# Altium schematic sheet MCU.SchDoc
size A; SheetNumber: 2; SheetTotal: 3
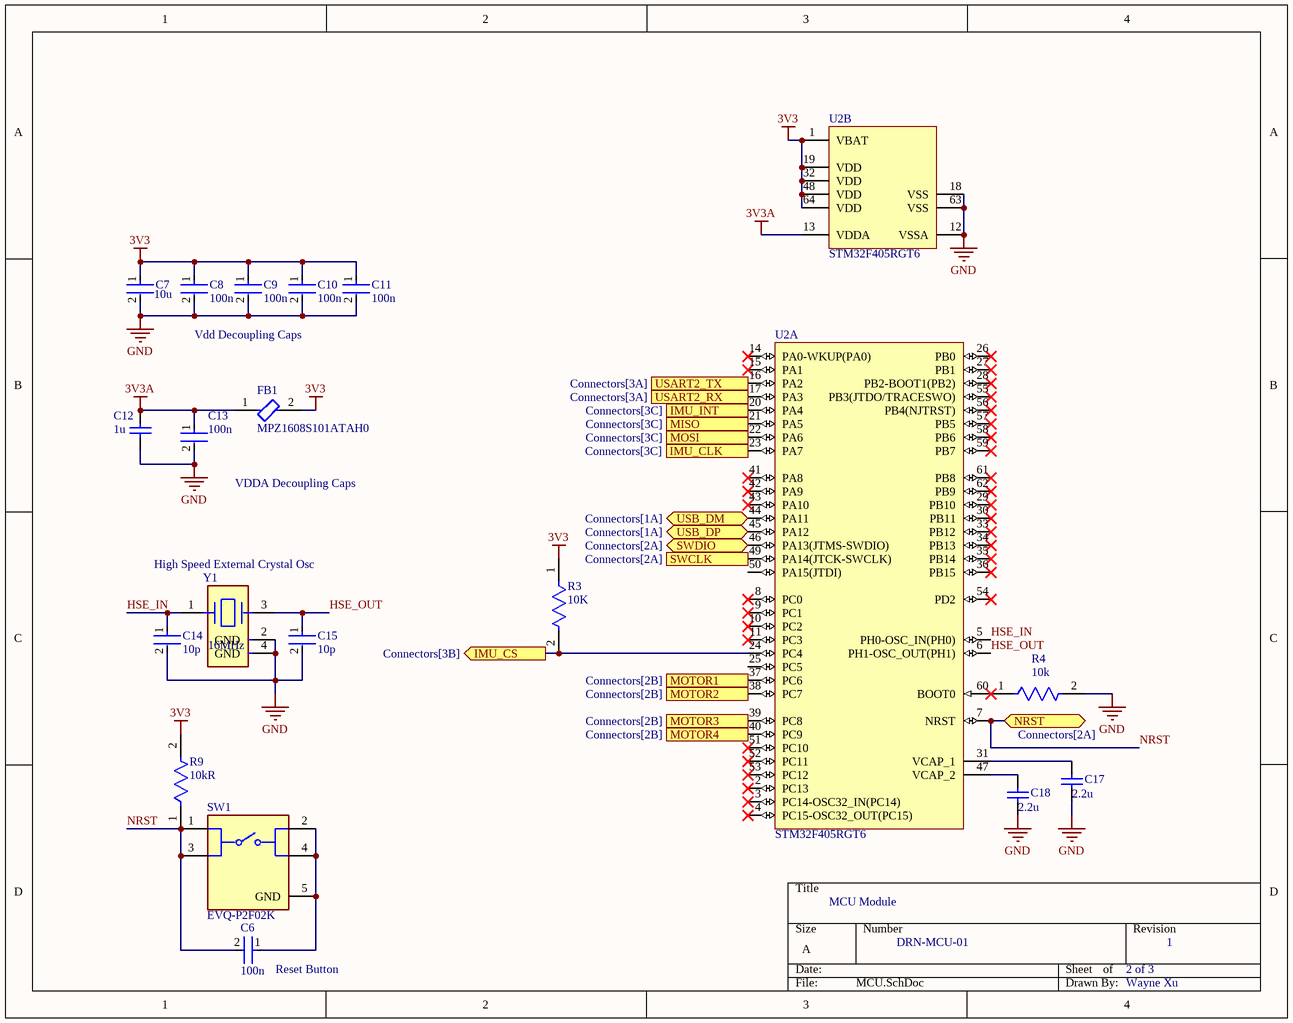
[diagram p0: MCU.SchDoc]

## Parts
C6  100n  [FP-C0603C-CF-MFG]
C7  10u  [FP-GRM155-0_2-MFG]
C8  100n  [FP-C0603C-CF-MFG]
C9  100n  [FP-C0603C-CF-MFG]
C10  100n  [FP-C0603C-CF-MFG]
C11  100n  [FP-C0603C-CF-MFG]
C12  1u  [CAPC2013X145X50LL20T25]
C13  100n  [FP-C0603C-CF-MFG]
C14  10p  [FP-C0603C-CF-MFG]
C15  10p  [FP-C0603C-CF-MFG]
C17  2.2u  [CAPC3216X180X50LL20T25]
C18  2.2u  [CAPC3216X180X50LL20T25]
FB1  MPZ1608S101ATAH0  [FP-MPZ1608-0_6-IPC_C]
R3  10K  [FP-AC0603-MFG]
R4  10k  [FP-AC0603-MFG]
R9  10kR  [FP-AC0603-MFG]
SW1  EVQ-P2F02K  [FP-EVQ-P2F02K-MFG]
U2  STM32F405RGT6  [STM-LQFP64_M]  (parts A,B of 2)
Y1  16MHz  [FP-ABM8W-MFG]

## Ports
IMU_CLK (out, see Connectors[3C]), IMU_CS (out, see Connectors[3B]), IMU_INT (in, see Connectors[3C]), MISO (in, see Connectors[3C]), MOSI (out, see Connectors[3C]), MOTOR1 (out, see Connectors[2B]), MOTOR2 (out, see Connectors[2B]), MOTOR3 (out, see Connectors[2B]), MOTOR4 (out, see Connectors[2B]), NRST (bidir, see Connectors[2A]), SWCLK (in, see Connectors[2A]), SWDIO (bidir, see Connectors[2A]), USART2_RX (in, see Connectors[3A]), USART2_TX (out, see Connectors[3A]), USB_DM (bidir, see Connectors[1A]), USB_DP (bidir, see Connectors[1A])

## Nets
3V3: C7.1 C8.1 C9.1 C10.1 C11.1 FB1.2 R3.1 R9.2 U2.1(VBAT) U2.19(VDD) U2.32(VDD) U2.48(VDD) U2.64(VDD)
3V3A: C12.1 C13.1 FB1.1 U2.13(VDDA)
GND: C7.2 C8.2 C9.2 C10.2 C11.2 C12.2 C13.2 C14.2 C15.2 C17.2 C18.2 R4.2 U2.12(VSSA) U2.18(VSS) U2.63(VSS) Y1.2(GND) Y1.4(GND)
HSE_IN: C14.1 U2.5(PH0-OSC_IN(PH0)) Y1.1
HSE_OUT: C15.1 U2.6(PH1-OSC_OUT(PH1)) Y1.3
IMU_CLK: U2.23(PA7) ; port IMU_CLK
IMU_CS: R3.2 U2.24(PC4) ; port IMU_CS
IMU_INT: U2.20(PA4) ; port IMU_INT
MISO: U2.21(PA5) ; port MISO
MOSI: U2.22(PA6) ; port MOSI
MOTOR1: U2.37(PC6) ; port MOTOR1
MOTOR2: U2.38(PC7) ; port MOTOR2
MOTOR3: U2.39(PC8) ; port MOTOR3
MOTOR4: U2.40(PC9) ; port MOTOR4
NRST: C6.2 R9.1 SW1.1 SW1.3 U2.7(NRST) ; port NRST
SWCLK: U2.49(PA14(JTCK-SWCLK)) ; port SWCLK
SWDIO: U2.46(PA13(JTMS-SWDIO)) ; port SWDIO
USART2_RX: U2.17(PA3) ; port USART2_RX
USART2_TX: U2.16(PA2) ; port USART2_TX
USB_DM: U2.44(PA11) ; port USB_DM
USB_DP: U2.45(PA12) ; port USB_DP
NetC6_1: C6.1 SW1.2 SW1.4 SW1.5(GND)
NetC17_1: C17.1 U2.31(VCAP_1)
NetC18_1: C18.1 U2.47(VCAP_2)
NetR4_1: R4.1 U2.60(BOOT0)

Not connected (* = marked no-connect by the designer): U2 2(PC13)* 3(PC14-OSC32_IN(PC14))* 4(PC15-OSC32_OUT(PC15))* 8(PC0)* 9(PC1)* 10(PC2)* 11(PC3)* 14(PA0-WKUP(PA0))* 15(PA1)* 25(PC5) 26(PB0)* 27(PB1)* 28(PB2-BOOT1(PB2))* 29(PB10)* 30(PB11)* 33(PB12)* 34(PB13)* 35(PB14)* 36(PB15)* 41(PA8)* 42(PA9)* 43(PA10)* 50(PA15(JTDI)) 51(PC10)* 52(PC11)* 53(PC12)* 54(PD2)* 55(PB3(JTDO/TRACESWO))* 56(PB4(NJTRST))* 57(PB5)* 58(PB6)* 59(PB7)* 61(PB8)* 62(PB9)*

## Notes on the sheet
- Vdd Decoupling Caps
- VDDA Decoupling Caps
- High Speed External Crystal Osc
- MCU Module
- (near C6) Reset Button
- DRN-MCU-01
- 2 of 3
- 1
- Wayne Xu

## Library data of the parts
C6 C8-C11 C13 = CMP-2006-03066-2: CAP CER 0.1UF 25V Y5V 0603; Manufacturer Part Number: C0603C104M3VACTU; Manufacturer: KEMET; Capacitance: 0.10 μF; Material: Ceramic; Temperature Coefficient: 30ppm/°C; Value: 0.10 μF; Automotive Grade: Grade 1; Tolerance: 0.2; Height: 0.87mm; Category: Cap; ComponentLink2Description: Datasheet; Temperature Range High: +125°C; Automotive: Yes; ComponentLink2URL: https://api.kemet.com/component-edge/download/datasheet/C0603C100J5GACAUTO.pdf; Mouser Description: Multilayer Ceramic Capacitors MLCC - SMD/SMT 25volts 0.1uF Y5V 20%; Device Class L2: Capacitors; Device Class L3: Ceramic Capacitors; Temperature: -55°C to +125°C; Lead Free: Yes; Temperature Range Low: -55°C; Package: C0603C-CF; RoHS: TRUE; Temperature Characteristic: Y5V; Octopart: https://octopart.com/c0603c104m3vactu-kemet-149363; Digikey Description: CAP CER 0.1UF 25V Y5V 0603; Voltage Rating: 25 V; Device Class L1: Passive Components
C7 = CMP-00260-135863761-1: GRM155D70G106ME18D SMD Chip Multilayer Ceramic Capacitor; Voltage Rating (DC): 4V; Dielectric: X7T; Capacitance: 10µF; Thickness: 500µm; Lifecycle Status: Production; Width: 500µm; Case/Package: 0402; NexarPartId: 135863761; Length: 1mm
C12 = CMP-1036-04746-2: Manufacturer: Kemet; Part Number: C0805C105K4PACTU
C14 C15 = CMP-03020-033857-1: CAP CER 10PF 100V C0G/NP0 0603; Manufacturer: KEMET; Manufacturer Part Number: C0603C100J1GACAUTO; Tolerance: 0.05; Temperature Coefficient: 30ppm/°C; Automotive Grade: Grade 1; Material: Ceramic; Temperature Characteristic: C0G; Temperature Range High: +125°C; Device Class L2: Capacitors; Value: 10 pF; Height: 0.87mm; Digikey Description: CAP CER 10PF 100V C0G/NP0 0603; RoHS: TRUE; Temperature Range Low: -55°C; Octopart: https://octopart.com/c0603c100j1gacauto-kemet-31033705; Voltage Rating: 100 V; ComponentLink2URL: https://api.kemet.com/component-edge/download/datasheet/C0603C100J5GACAUTO.pdf; Device Class L1: Passive Components; Automotive: Yes; ComponentLink2Description: Datasheet; Device Class L3: Ceramic Capacitors; Category: Cap; Temperature: -55°C to +125°C; Mouser Description: Cap Ceramic 10pF 100V C0G 5% Pad SMD 0603 125C Automotive T/R; Capacitance: 10 pF; Package: C0603C-CF; Lead Free: Yes
C17 C18 = CMP-1037-04812-2: Chip Capacitor, 2.2 uF, +/- 10%, 16 V, -55 to 125 degC, 1206 (3216 Metric), RoHS, Tape and Reel; Manufacturer: Kemet; Capacitance - nF: 2200nF; Voltage Rating DC: 16V; Class: Class1; Temperature Coefficient / Code: +/-15%; Case Height: 1mm; Dissipation Factor DF: 5; Capacitance: 2.2uF; Type: SMDMLCCX7R6.3-250VDCCommericalGrade; Case Width: 1.6mm; Dielectric: X7R; Case Length: 3.2mm; Series: C1206C; Tolerance: 10%; Datasheet URL: http://www.kemet.com/docfinder?Partnumber=C1206C106K8RACTU; Package Description: 2-Pin Surface Mount Device, Body 3.2 x 1.6 mm; RoHS: Details; Datasheet Version: 02/2016; Package / Case: 1206(3216metric); Case Code - mm: 3216; Packaging: Reel; Product Category: MultilayerCeramicCapacitorsMLCC-SMD/SMT; Package Reference: 1206; Maximum Operating Temperature: +125C; Mounting Technology: SurfaceMount; Dimensions: 1.6mmWx3.2mmLx1mmH; Case Code - in: 1206; Minimum Operating Temperature: -55C; Operating Temperature Range: -55Cto+125C; Brand: Kemet; Product: GeneralTypeMLCCs; Factory Pack Quantity: 2000; Voltage Rating: 16V; Termination Style: SMD/SMT; Manufacturer URL: http://www.kemet.com/
FB1 = CMP-08257-000005-2: FERRITE BEAD 100 OHM 0603 1LN; Max DC Current: 3A; Tolerance: 25%; Impedance: 100R; DC Resistance (DCR): 30mR; Packaging: Tape and Reel; Length: 0.063inch; Depth: 0.8mm; Current Rating: 3A; Mount: Surface Mount; Width: 0.031inch; Case Code (Imperial): 0603; Case Code (Metric): 1608; Height: 0.03inch; Core Material: Ferrite; REACH SVHC: No SVHC; Package Quantity: 4000; RoHS Compliant: Yes; Case/Package: 0603
R3 R4 R9 = CMP-03412-038553-1: RES 10kΩ 1.00% 0.2W 0603
SW1 = CMP-05618-000109-1: SWITCH TACTILE SPST-NO 0.02A 15V; Electrical Life: 200000Cycles; Contact Resistance: 100mR; Contact Current Rating: 20mA; Illumination Type: Non-Illuminated; Switch Travel: 0.7mm; Throw Configuration: SPST; Switch Function: Off-Mom; Actuator Type: Standard; Actuator Color: Black; Operating Force: 5N; Actuator Length: 0.85mm; Max Voltage Rating (DC): 15V; Radiation Hardening: No; Package Quantity: 1; Current Rating: 20mA; Max Operating Temperature: 85°C; Min Operating Temperature: -40°C; Max Current Rating: 20mA; Voltage Rating (DC): 15V; Depth: 5.5mm; Packaging: Tape and Reel; Mount: Surface Mount; Termination: J-Bend; Size: 3.5mm; Series: EVQP2; Length: 3.5mm; Lead Free: Lead Free; Orientation: Straight; RoHS Compliant: Yes; Mechanical Life: 200000Cycles
U2 = CMP-0243-00019-3: ARM Cortex-M4 32-bit MCU+FPU, 210 DMIPS, 1024 kB Flash, 192 kB Internal RAM, 51 I/Os, 64-pin LQFP, -40 to 85 degC, Tray; Manufacturer: STMicroelectronics; Supply Voltage(Vcc) min (V): 1.8; Supply Voltage(Vcc) max (V): 3.6; Internal RAM Size (kB): 192; I/Os (High Current): 51; D/A Converter: 2x12-bit; FLASH Size (Prog) (kB): 1024; Operating Frequency(F) (Processor speed) (MHz): 168; ComponentLink2Description: Datasheet; PackageVersion: Rev. 4, 06/2013; DatasheetVersion: Rev. 4; Core: ARM Cortex-M4; ComponentLink2URL: http://www.st.com/st-web-ui/static/active/en/resource/technical/document/datasheet/DM00037051.pdf; PackageReference: LQFP64; Packing: Tray; ComponentLink1Description: Manufacturer URL; ComponentLink3URL: http://www.st.com/st-web-ui/static/active/en/resource/technical/document/datasheet/DM00037051.pdf; ComponentLink3Description: Package Specification; Mounting Technology: Surface Mount; ComponentLink1URL: http://www.st.com/web/en/home.html; PackageDescription: 64-Pin Low Profile Quad Flat Package, 10 x 10 mm Body, 0.5 mm Pitch; PartNumber: STM32F405RGT6
Y1 = CMP-27762-014646-1: Crystal 16MHz ±10ppm (Tol) ±10ppm (Stability) 7pF FUND 70Ω 4-Pin SMD T/R